# EAGLE design dice (EAGLE 6.3)
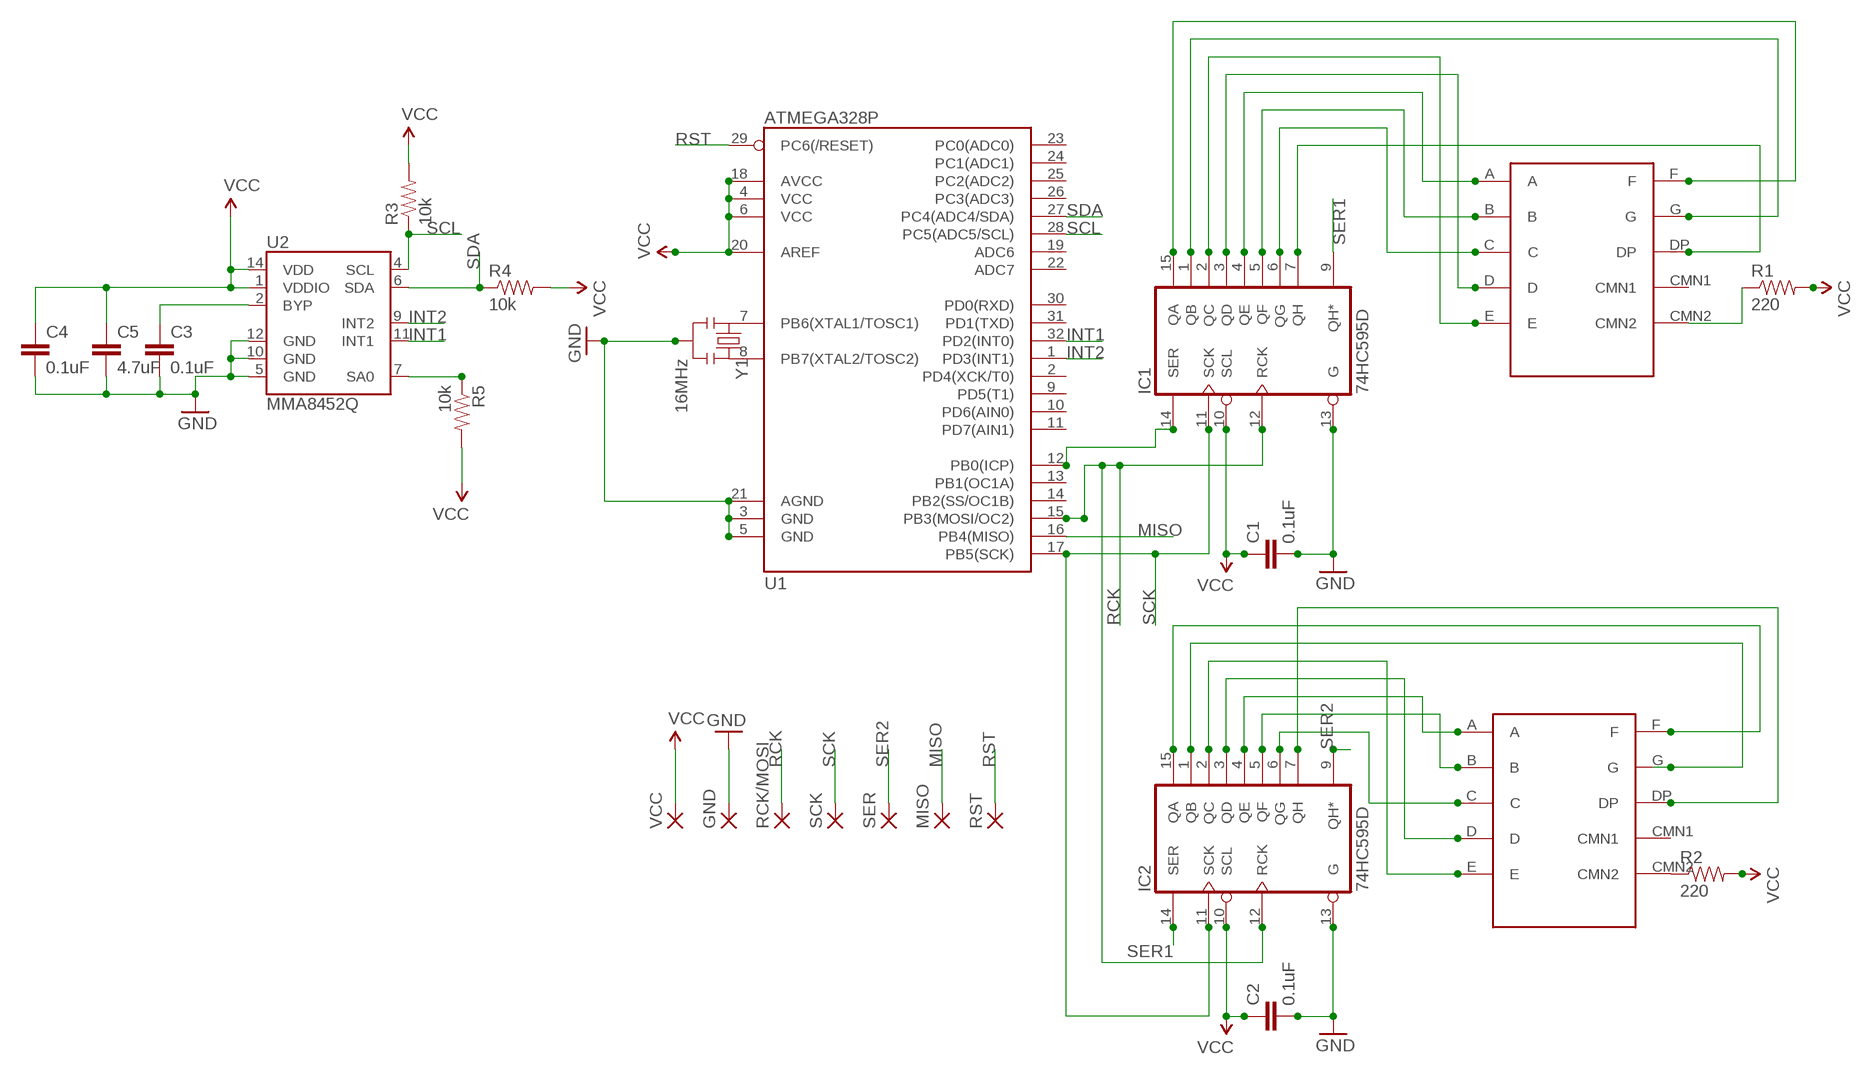
[diagram p0: schematic, sheet 1]

## Parts
C1  0.1uF  .1UF-CER  [0402-CAP]
C2  0.1uF  .1UF-CER  [0402-CAP]
C3  0.1uF  .1UF-CER  [0402-CAP]
C4  0.1uF  .1UF-CER  [0402-CAP]
C5  4.7uF  4.7UF-6.3V-10%(0603)  [0402-CAP]
GND  1,6/0,8  [1,6/0,8]
IC1  74HC595D  [SO16]
IC2  74HC595D  [SO16]
MISO  1,6/0,8  [1,6/0,8]
R1  220  220-5%  [0603-RES]
R2  220  220-5%  [0603-RES]
R3  10k  RESISTOR0402-RES  [0402-RES]
R4  10k  RESISTOR0402-RES  [0402-RES]
R5  10k  RESISTOR0402-RES  [0402-RES]
RCK/MOSI  1,6/0,8  [1,6/0,8]
RST  1,6/0,8  [1,6/0,8]
SCK  1,6/0,8  [1,6/0,8]
SER  1,6/0,8  [1,6/0,8]
U1  ATMEGA328P  ATMEGA328_SMT  [TQFP32-08]
U2  MMA8452Q  [QFN-16_0.5MM]
U$1  LUMEXSMHTA5604RISIT  [7SEG-10SMD]
U$2  LUMEXSMHTA5604RISIT  [7SEG-10SMD]
VCC  1,6/0,8  [1,6/0,8]
Y1  16MHz  RESONATOR16MHZ  [RESONATOR-SMD]

## Nets
GND: C1.2 C2.2 C3.2 C4.2 C5.2 GND.1(P) IC1.13(G) IC2.13(G) U1.3(GND) U1.5(GND) U1.21(AGND) U2.5(GND) U2.10(GND) U2.12(GND) Y1.2
INT1: U1.32(PD2(INT0)) U2.11(INT1)
INT2: U1.1(PD3(INT1)) U2.9(INT2)
MISO: MISO.1(P) U1.16(PB4(MISO))
N$1: R1.1 U$1.CMN2
N$2: IC1.4(QE) U$1.A
N$3: IC1.14(SER) U1.12(PB0(ICP))
N$4: U1.8(PB7(XTAL2/TOSC2)) Y1.3
N$5: U1.7(PB6(XTAL1/TOSC1)) Y1.1
N$6: IC1.15(QA) U$1.F
N$7: IC1.1(QB) U$1.G
N$8: IC1.2(QC) U$1.E
N$9: IC1.3(QD) U$1.D
N$10: IC1.5(QF) U$1.B
N$11: IC1.6(QG) U$1.C
N$12: IC1.7(QH) U$1.DP
N$13: R2.1 U$2.CMN2
N$14: IC2.15(QA) U$2.F
N$15: IC2.1(QB) U$2.G
N$16: IC2.2(QC) U$2.E
N$17: IC2.3(QD) U$2.D
N$18: IC2.4(QE) U$2.A
N$19: IC2.5(QF) U$2.B
N$20: IC2.6(QG) U$2.C
N$21: IC2.7(QH) U$2.DP
N$24: R5.1 U2.7(SA0)
N$26: C3.1 U2.2(BYP)
RCK: IC1.12(RCK) IC2.12(RCK) RCK/MOSI.1(P) U1.15(PB3(MOSI/OC2))
RST: RST.1(P) U1.29(PC6(/RESET))
SCK: IC1.11(SCK) IC2.11(SCK) SCK.1(P) U1.17(PB5(SCK))
SCL: R3.1 U1.28(PC5(ADC5/SCL)) U2.4(SCL)
SDA: R4.1 U1.27(PC4(ADC4/SDA)) U2.6(SDA)
SER1: IC1.9(QH*) IC2.14(SER)
SER2: IC2.9(QH*) SER.1(P)
VCC: C1.1 C2.1 C4.1 C5.1 IC1.10(SCL) IC2.10(SCL) R1.2 R2.2 R3.2 R4.2 R5.2 U1.4(VCC) U1.6(VCC) U1.18(AVCC) U1.20(AREF) U2.1(VDDIO) U2.14(VDD) VCC.1(P)
Unconnected: U1.2(PD4(XCK/T0)) U1.9(PD5(T1)) U1.10(PD6(AIN0)) U1.11(PD7(AIN1)) U1.13(PB1(OC1A)) U1.14(PB2(SS/OC1B)) U1.19(ADC6) U1.22(ADC7) U1.23(PC0(ADC0)) U1.24(PC1(ADC1)) U1.25(PC2(ADC2)) U1.26(PC3(ADC3)) U1.30(PD0(RXD)) U1.31(PD1(TXD)) U$1.CMN1 U$2.CMN1

## Power pins joined to a net without a drawn wire
GND: IC1.8(GND) IC2.8(GND)
VCC: IC1.16(VCC) IC2.16(VCC)

## Library data of the parts
C1-C4 = SparkFun-Capacitors:.1UF-CER: .1uF ceramic SMT CAP-00810- 25V +80%/-20% (0603) CAP-08390- 100V 10% (0603) CAP-08604- 25V 5% (0603); PROD_ID: CAP-00810
C5 = SparkFun-Capacitors:4.7UF-6.3V-10%(0603): CAP-08280; PROD_ID: CAP-08280
GND MISO RCK/MOSI RST SCK SER VCC = wirepad:1,6/0,8: THROUGH-HOLE PAD
IC1 IC2 = 74xx-eu:74*595: 8-bit SHIFT REGISTER, output latch
R1 R2 = SparkFun-Resistors:220-5%: 220-ohm SMT 1/8W - 5% (0805) RES-07866; PROD_ID: RES-07866
R3-R5 = SparkFun-Resistors:RESISTOR: Resistor Basic schematic elements and footprints for 0603, 1206, and PTH resistors.
U1 = SparkFun-DigitalIC:ATMEGA328_SMT: 32-Pin Atmega328 part Commonly used on Arduino compatible boards Available in QFP and QFN packages TQFP is IC-09069 QFN is non-stock; PROD_ID: IC-09069
U2 = SparkFun-Sensors:MMA8452Q: MMA8452Q 3-Axis, 12/8-bit Digital Accelerometer Supply Voltage: 1.6-3.6V Range: +/- 2g, 4g, 8g Interface: I2C, 12-bit and 8-bit ODR: 1.56 Hz - 800 Hz Package: QFN-16 http://cache.freescale.com/files/sensors/doc/data_sheet/MMA8452Q.pdf
U$1 U$2 = sevensegment:LUMEXSMHTA5604RISIT: Red 10 pin SMD 0.56" 7 Segment
Y1 = SparkFun-FreqCtrl:RESONATOR: Resonator Small SMD resonator. Used, eg, on the Arduino Pro/ Pro Mini boards. 8MHz- XTAL-08895 16MHz- XTAL-08900; PROD_ID: XTAL-08900

## Board
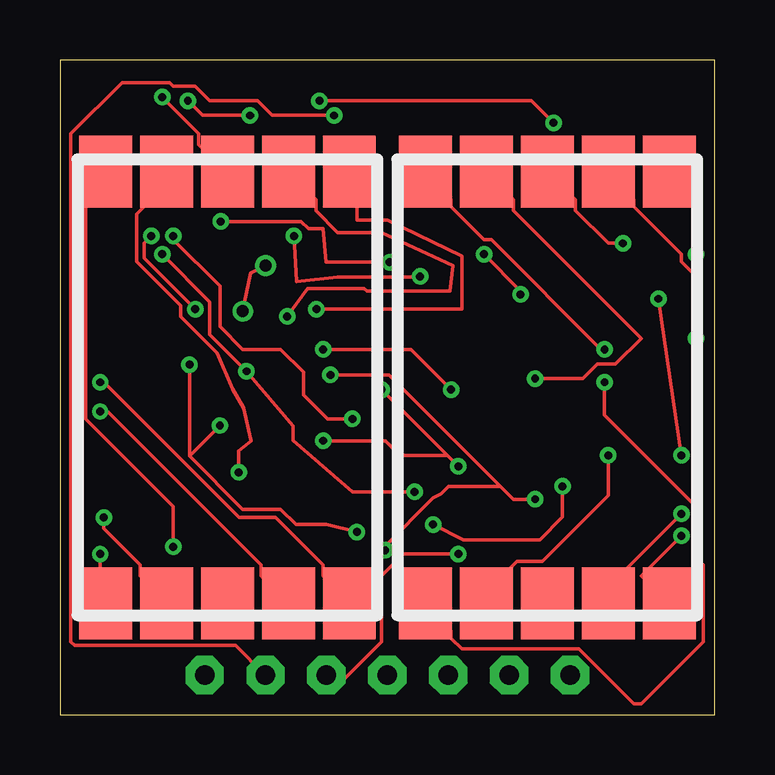
[diagram p1: board, top side]
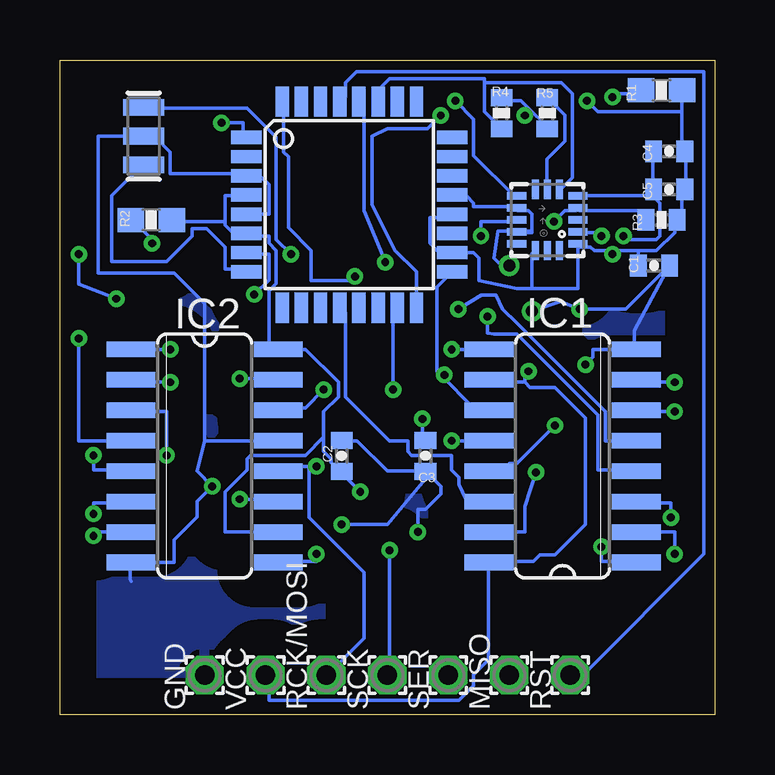
[diagram p2: board, bottom side, seen from below]

Size 27.3 x 27.3 mm. Coordinates in mm from the lower left corner, seen from the top.
Outline: 27.3,0 27.3,27.3 0,27.3 0,0 27.3,0
Copper layers (1*16): Top 0.0356mm / dielectric 1.5011mm / Bottom 0.0356mm
Design rules "LaenPCBOrder": minimum track width 6mil, minimum drill 13mil, track to track 6mil, track to pad 6mil, pad to pad 6mil, via to via 6mil, smd to smd 6mil, copper to edge 15mil, drill to drill 6mil, minimum pad ring 7mil, minimum via ring 7mil, stop-mask expansion 4mil, vias tented up to drill 0mil, thermal gap 10mil

### Footprints (pad centres in the part's own frame; a part is rotated, then mirrored left to right if it is on the bottom)
0402-CAP = smd 0.7 x 0.9: 1 -0.65,0; 2 0.65,0
1,6/0,8 = drill 0.813 pad 1.6 octagon: 1 0,0
SO16 = smd 0.66 x 2.032: 1 -4.445,-3.073; 2 -3.175,-3.073; 3 -1.905,-3.073; 4 -0.635,-3.073; 5 0.635,-3.073; 6 1.905,-3.073; 7 3.175,-3.073; 8 4.445,-3.073; 9 4.445,3.073; 10 3.175,3.073; 11 1.905,3.073; 12 0.635,3.073; 13 -0.635,3.073; 14 -1.905,3.073; 15 -3.175,3.073; 16 -4.445,3.073
0603-RES = smd 1.1 x 1: 1 -0.85,0; 2 0.85,0
0402-RES = smd 0.7 x 0.9: 1 -0.65,0; 2 0.65,0
TQFP32-08 = smd 1.27 x 0.559: 1 -4.293,2.8; 2 -4.293,2; 3 -4.293,1.2; 4 -4.293,0.4; 5 -4.293,-0.4; 6 -4.293,-1.2; 7 -4.293,-2; 8 -4.293,-2.8; 17 4.293,-2.8; 18 4.293,-2; 19 4.293,-1.2; 20 4.293,-0.4; 21 4.293,0.4; 22 4.293,1.2; 23 4.293,2; 24 4.293,2.8 | smd 0.559 x 1.27: 9 -2.8,-4.293; 10 -2,-4.293; 11 -1.2,-4.293; 12 -0.4,-4.293; 13 0.4,-4.293; 14 1.2,-4.293; 15 2,-4.293; 16 2.8,-4.293; 25 2.8,4.293; 26 2,4.293; 27 1.2,4.293; 28 0.4,4.293; 29 -0.4,4.293; 30 -1.2,4.293; 31 -2,4.293; 32 -2.8,4.293
QFN-16_0.5MM = smd 0.8 x 0.3: 1 -1.275,1; 2 -1.275,0.5; 3 -1.275,0; 4 -1.275,-0.5; 5 -1.275,-1; 9 1.275,-1; 10 1.275,-0.5; 11 1.275,0; 12 1.275,0.5; 13 1.275,1 | smd 0.3 x 0.8: 6 -0.5,-1.275; 7 0,-1.275; 8 0.5,-1.275; 14 0.5,1.275; 15 0,1.275; 16 -0.5,1.275
7SEG-10SMD = smd 2.2 x 3: A 2.54,9; B 5.08,9; C 2.54,-9; CMN1 0,-9; CMN2 0,9; D -2.54,-9; DP 5.08,-9; E -5.08,-9; F -2.54,9; G -5.08,9
RESONATOR-SMD = smd 0.7 x 1.7: 1 -1.2,0; 2 0,0; 3 1.2,0

### Placement (x,y rotation side)
C1  2.54,18.73 0 bottom
C2  15.56,10.79 90 bottom
C3  12.06,10.79 270 bottom
C4  1.91,23.5 180 bottom
C5  1.91,21.91 180 bottom
GND  21.27,1.65 0 bottom
IC1  6.35,10.79 90 bottom
IC2  21.27,10.79 270 bottom
MISO  8.57,1.65 0 bottom
R1  2.22,26.04 0 bottom
R2  23.5,20.64 0 bottom
R3  2.22,20.64 0 bottom
R4  8.89,25.08 90 bottom
R5  6.99,25.08 270 bottom
RCK/MOSI  16.19,1.65 0 bottom
RST  6.03,1.65 0 bottom
SCK  13.65,1.65 0 bottom
SER  11.11,1.65 0 bottom
U1  15.24,21.27 0 bottom
U2  6.99,20.64 180 bottom
U$1  6.99,13.65 0 top
U$2  20.32,13.65 0 top
VCC  18.73,1.65 0 bottom
Y1  23.81,24.13 270 bottom

### Tracks (layer width: path | path; a pad name or v marks a point on that pad's centre or on a via)
GND  (via drill 0.33, 0.5)
  Top 0.152: v3.81,19.96 3.5,19.66 3.5,19.05 v5.64,16.92 | v8.57,18.73 7.94,18.41 v7.62,16.83 | v15.56,7.94 16.83,7.3 20,7.3 20.95,8.26 v20.95,9.53 | 5.4,10.79 7.62,8.57 9.21,8.57 9.84,7.94 11.11,7.94 v12.38,7.62 | v6.67,12.06 5.4,10.79 | v5.4,14.61 5.4,10.79
  Bottom 0.152: 2.59,21.64 5.64,21.64 U2.5 | 2.59,21.64 2.59,21.79 C5.2 | C4.2 2.59,23.47 2.59,21.95 C5.2 | 7.62,20.16 7.62,20.88 7.77,21.03 8.23,21.03 U2.10 8.38,21.18 10.06,21.18 10.06,21.34 10.36,21.64 10.82,21.64 U1.21 | 7.62,20.16 7.62,20.12 8.23,20.12 U2.12 | U1.5 19.51,20.88 18.59,20.88 18.59,22.1 18.9,22.4 19.51,22.4 U1.3 19.66,22.55 22.71,22.55 22.71,23.47 23.32,24.08 23.77,24.08 Y1.2 25.72,24.13 25.72,18.41 22.54,18.41 21.27,17.14 21.27,11.43 | 3.35,15.24 3.35,16.03 C1.2 3.71,16.92 v5.64,16.92 6.44,17.23 v7.62,16.83 | 3.35,15.24 IC1.8 | 24.35,5.56 24.38,5.64 24.38,6.25 IC2.8 22.54,6.35 22.54,7.3 21.59,8.26 21.59,8.89 v20.95,9.53 21.59,10.16 21.27,11.43 | 2.59,21.64 2.29,21.34 2.29,19.96 2.44,19.81 3.81,19.81 v3.81,19.96 | 2.59,21.64 C5.2 | 7.62,20.16 9.05,20.16 9.21,19.05 8.89,18.73 v8.57,18.73 | IC1.13 8.89,10.16 8.57,10.48 8.26,10.48 v6.67,12.06 | C3.2 11.43,9.53 11.43,9.21 12.06,8.57 12.38,8.57 v12.38,7.62 | C2.2 15.56,11.43 14.92,11.43 13.65,10.16 12.08,10.16 C3.2 | C3.2 12.06,9.84 13.65,7.94 v15.56,7.94 | 21.27,11.43 IC2.13 | 3.35,15.24 5.08,15.24 5.08,14.92 v5.4,14.61
  pour Bottom (isolate 1.524): -2.54,28.57 -2.54,-1.91 30.48,-1.91 30.8,28.26
INT1  (via drill 0.33)
  Top 0.152: v9.75,19.96 9.87,18.06 11.58,18.25 14.99,18.25 v15.01,18.27
  Bottom 0.152: v9.75,19.96 9.75,20.57 8.38,20.57 U2.11 | U1.32 17.98,25.45 17.98,23.47 17.78,23.27 17.78,20.32 16.83,19.37 16.83,18.1 15.19,18.1 v15.01,18.27
INT2  (via drill 0.33)
  Top 0.152: v10.82,25.6 19.66,25.6 v20.57,24.69
  Bottom 0.152: v10.82,25.6 10.06,24.84 10.06,23.32 8.38,21.64 U2.9 | v20.57,24.69 19.66,24.69 19.66,24.08 U1.1
MISO  (via drill 0.33)
  Top 0.152: v11.43,24.99 8.84,24.99 8.23,25.6 6.25,25.6 5.64,26.21 4.72,26.21 4.57,26.36 2.59,26.36 0.46,24.23 0.46,3.05 0.61,2.9 7.32,2.9 8.53,1.68 MISO.1
  Bottom 0.152: v11.43,24.99 11.98,24.45 13.65,24.45 14.29,24.13 14.29,21.27 13.34,19.37 12.44,18.47 U1.16 12.5,17.07
N$1  (via drill 0.33)
  Top 0.152: v4.27,25.76 5.79,24.23 5.79,23.77 6.86,22.71 U$1.CMN2
  Bottom 0.152: v4.27,25.76 4.27,25.91 3.2,25.91 R1.1
N$2  (via drill 0.33)
  Top 0.152: v9.47,16.61 10.32,17.78 12.69,17.78 12.8,17.67 16.27,17.67 16.38,18.73 13.41,20.12 11.58,20.12 10.67,21.03 10.67,21.49 9.6,22.55 U$1.A
  Bottom 0.152: IC1.4 3.35,10.21 4.88,10.21 4.88,12.5 8.26,15.88 9.21,15.88 9.47,15.93 v9.47,16.61
N$3
  Bottom 0.152: U1.12 15.54,16.92 15.39,16.76 15.39,13.26 13.56,11.43 12.8,11.43 12.8,10.97 12.65,10.82 10.97,10.82 10.97,10.21 10.67,9.91 10.67,9.6 10.38,8.99 9.77,8.99 IC1.14
N$4
  Bottom 0.152: U1.8 19.66,18.59 20.42,18.59 20.42,19.51 21.18,20.27 21.79,20.27 21.79,19.96 22.86,18.9 25.15,18.9 25.15,21.64 23.93,22.86 Y1.3
N$5  (via drill 0.33)
  Top 0.152: v19.2,17.53 19.2,17.68 v17.68,19.2
  Bottom 0.152: v19.2,17.53 18.59,18.14 18.59,19.2 19.51,19.2 U1.7 | v17.68,19.2 18.29,19.81 18.29,24.08 19.51,25.3 23.77,25.3 Y1.1
N$6  (via drill 0.33)
  Top 0.152: v7.46,10.11 7.46,11 7.98,11.43 7.66,12.8 7.19,13.59 6.55,15.09 5.03,16.61 5.03,17.07 3.2,18.9 3.2,20.88 4.72,22.4 4.57,22.55 U$1.F
  Bottom 0.152: IC1.15 7.92,7.62 7.92,8.69 v7.46,10.11
N$7  (via drill 0.33)
  Top 0.152: v4.72,7.01 4.72,8.69 1.07,12.34 1.07,21.79 1.83,22.55 U$1.G
  Bottom 0.152: v4.72,7.01 4.72,6.4 3.35,6.4 IC1.1
N$8  (via drill 0.33)
  Top 0.152: v1.68,6.71 1.68,4.88 1.83,4.72 U$1.E
  Bottom 0.152: IC1.2 1.68,7.62 v1.68,6.71
N$9  (via drill 0.33)
  Top 0.152: v1.83,8.23 1.83,7.77 3.35,6.25 3.35,5.79 4.42,4.72 U$1.D
  Bottom 0.152: v1.83,8.23 1.83,8.84 3.2,8.84 IC1.3
N$10  (via drill 0.33)
  Top 0.152: v10.69,16.92 16.76,16.92 16.75,19.13 13.65,20.64 12.38,20.64 12.38,22.36 12.19,22.55 U$1.B
  Bottom 0.152: IC1.5 4.57,11.43 4.57,12.65 8.23,16.31 8.87,16.92 9.13,17.5 9.74,17.5 v10.69,16.92
N$11  (via drill 0.33)
  Top 0.152: v1.68,12.65 1.98,12.65 8.38,6.25 8.38,5.79 9.45,4.72 U$1.C
  Bottom 0.152: v1.68,12.65 3.2,12.65 IC1.6
N$12  (via drill 0.33)
  Top 0.152: v1.68,13.87 1.83,13.87 7.47,8.23 8.99,8.23 10.97,6.25 10.97,5.79 12.04,4.72 U$1.DP
  Bottom 0.152: v1.68,13.87 3.2,13.87 IC1.7
N$13  (via drill 0.33)
  Top 0.152: v23.47,19.66 22.86,19.66 21.49,21.03 21.49,21.49 20.42,22.55 U$2.CMN2
  Bottom 0.152: v23.47,19.66 23.47,19.81 24.23,20.57 R2.1
N$14  (via drill 0.33)
  Top 0.152: v19.81,14.02 21.79,14.02 22.4,14.63 23.16,14.63 24.23,15.7 18.9,21.03 18.9,21.49 17.83,22.55 U$2.F
  Bottom 0.152: v19.81,14.02 18.29,14.02 IC2.15
N$15  (via drill 0.33)
  Top 0.152: v22.71,15.24 22.55,15.24 17.98,19.81 17.68,19.81 16.31,21.18 16.31,21.49 15.24,22.55 U$2.G
  Bottom 0.152: v22.71,15.24 IC2.1
N$16  (via drill 0.33)
  Top 0.152: v22.71,13.87 22.71,12.5 26.52,8.69 26.52,6.55 26.82,6.25 26.82,3.05 24.23,0.46 23.93,0.46 21.64,2.74 16.76,2.74 16.31,3.2 16.31,3.5 15.24,4.57 U$2.E
  Bottom 0.152: v22.71,13.87 24.23,13.87 IC2.2
N$17  (via drill 0.33)
  Top 0.152: v22.86,10.82 22.86,9.14 20.12,6.4 19.05,6.4 17.53,4.88 17.68,4.72 U$2.D
  Bottom 0.152: v22.86,10.82 22.86,12.65 24.23,12.65 IC2.3
N$18  (via drill 0.33)
  Top 0.152: v26.52,15.7 26.52,18.29 25.91,18.9 25.91,19.2 23.93,21.18 23.93,21.49 22.86,22.55 U$2.A
  Bottom 0.152: IC2.4 26.52,11.43 v26.52,15.7
N$19  (via drill 0.33)
  Top 0.152: v24.96,17.35 v25.91,10.82 | v26.52,19.2 26.52,21.49 25.45,22.55 U$2.B
  Bottom 0.152: v25.91,10.82 25.91,10.21 24.38,10.21 IC2.5 | v24.96,17.35 26.52,17.96 v26.52,19.2
N$20  (via drill 0.33)
  Top 0.152: v25.91,8.38 22.55,5.03 22.86,4.72 U$2.C
  Bottom 0.152: v25.91,8.38 25.91,8.84 24.38,8.84 IC2.6
N$21  (via drill 0.33)
  Top 0.152: v25.91,7.47 24.23,5.79 25.3,4.72 U$2.DP
  Bottom 0.152: IC2.7 25.91,7.62 v25.91,7.47
N$24
  Bottom 0.152: U2.7 7.01,21.95 7.01,23.16 6.25,23.93 6.25,24.99 6.86,25.6 R5.1
N$26  (via drill 0.33)
  Top 0.152: v4.72,19.96 4.72,19.81 6.67,17.87 6.67,16.19 7.62,15.24 9.21,15.24 10.16,14.29 10.16,13.34 11.15,12.34 v12.19,12.34
  Bottom 0.152: v4.72,19.96 4.72,20.12 5.64,20.12 U2.2 | v12.19,12.34 12.19,11.58 C3.1
RCK  (via drill 0.33)
  Top 0.152: v16.61,10.36 16.15,10.82 | 16.15,10.82 v13.41,13.56 | v10.97,11.43 13.56,11.43 14.17,10.82 16.15,10.82
  Bottom 0.152: v13.41,13.56 13.41,16.76 13.26,16.92 U1.15 | 16.92,10.36 18.14,10.36 18.14,10.21 IC2.12 | v10.97,11.43 IC1.12 | 16.92,10.36 16.92,8.23 14.63,5.94 14.63,3.2 16.15,1.68 RCK/MOSI.1 | 16.92,10.36 v16.61,10.36
RST
  Bottom 0.152: U1.29 15.54,25.6 15.39,25.76 15.39,26.36 14.94,26.82 0.46,26.82 0.46,6.71 5.49,1.68 5.94,1.68 RST.1
SCK  (via drill 0.33)
  Top 0.152: v19.81,8.99 18.9,8.99 18.36,9.53 | 18.36,9.53 13.72,14.17 v11.28,14.17 | 18.36,9.53 16.19,9.53 15.88,9.21 15.56,9.05 13.56,7.05 v13.56,6.86
  Bottom 0.152: 11.43,14.17 10.06,12.8 9.45,12.8 IC1.11 | 11.43,14.17 11.58,14.33 11.58,17.83 10.97,18.44 U1.17 | v19.81,8.99 18.29,8.99 IC2.11 | 11.43,14.17 v11.28,14.17 | v13.56,6.86 13.56,1.68 SCK.1
SCL  (via drill 0.33)
  Top 0.152: v13.74,18.87 11.1,18.87 10.97,20.27 10.36,20.27 10.06,20.57 v6.71,20.57
  Bottom 0.152: R3.1 2.9,20.73 2.9,21.03 5.64,21.03 U2.4 5.79,21.03 6.25,21.03 v6.71,20.57 | v13.74,18.87 14.63,21.03 14.63,25.3 14.78,25.45 U1.28
SDA
  Bottom 0.152: 9.6,26.36 6.4,26.36 5.94,25.91 5.94,22.4 6.4,21.95 U2.6 | 9.6,26.36 9.6,25.15 8.99,24.54 R4.1 | 9.6,26.36 9.6,26.52 13.56,26.52 13.87,26.21 13.87,25.76 14.02,25.6 U1.27
SER1  (via drill 0.33)
  Top 0.152: v10.97,15.24 14.63,15.24 v16.31,13.56
  Bottom 0.152: v10.97,15.24 IC1.9 | v16.31,13.56 17.07,12.8 18.14,12.8 IC2.14
SER2  (via drill 0.33)
  Top 0.152: v16.61,6.71 14.33,6.71 13.41,5.79 13.41,3.05 11.58,1.22 11.12,1.68 SER.1
  Bottom 0.152: v16.61,6.71 16.61,6.4 18.14,6.4 IC2.9
VCC  (via drill 0.33)
  Top 0.152: v7.92,24.99 5.94,24.99 v5.33,25.6 | v4.27,19.2 6.25,17.22 6.25,15.85 v7.77,14.33 9.73,12.05 9.73,11.44 12.19,9.3 v14.78,9.3
  Bottom 0.152: 20.42,20.57 22.55,20.57 R2.2 | 20.42,20.57 20.42,20.42 20.12,20.12 19.66,20.12 U1.6 19.51,19.96 18.59,19.96 18.59,19.66 18.29,19.36 18.29,17.98 18.59,17.68 18.59,15.54 18.29,15.24 IC2.16 17.07,15.24 15.7,13.87 15.7,13.26 16.31,12.65 16.31,11.58 | 20.42,20.57 20.42,21.64 19.66,21.64 U1.4 | 16.31,11.58 16.31,10.97 16,10.67 16,10.52 15.7,10.21 C2.1 15.54,10.06 v14.78,9.3 | IC2.10 20.42,7.62 20.42,9.3 19.51,10.21 19.51,10.67 19.36,10.82 17.07,10.82 16.31,11.58 | U1.20 10.97,20.73 11.89,20.73 11.89,19.66 11.58,19.36 10.97,19.36 U1.18 10.06,19.27 9.84,19.05 9.84,18.1 8.26,17.78 7.62,17.78 | 3.2,19.36 4.27,19.36 | 4.27,19.36 5.03,19.36 5.18,19.51 5.64,19.51 U2.1 5.71,17.78 7.62,17.78 | 3.2,19.36 3.2,18.75 C1.1 | 7.77,25.3 8.08,25.6 8.84,25.6 R4.2 | 7.77,25.3 7.01,24.54 R5.2 | 1.37,25.15 1.37,23.62 C4.1 1.22,23.47 1.22,21.95 C5.1 1.37,21.79 1.37,20.88 1.52,20.73 R3.2 1.68,20.57 1.68,20.12 2.44,19.36 3.2,19.36 | 1.37,25.15 1.37,25.91 R1.2 | 7.77,25.3 7.92,25.15 v7.92,24.99 | v5.33,25.6 4.88,25.15 1.37,25.15 | VCC.1 18.59,1.52 18.59,0.61 10.67,0.61 10.06,1.22 10.06,1.68 9.45,2.29 9.45,6.25 IC1.16 9.3,6.4 7.57,6.4 7.3,6.67 6.67,6.67 5.4,7.94 5.4,12.38 6.67,13.65 7.71,13.65 7.92,13.87 | 7.92,13.87 9.3,13.87 IC1.10 | v4.27,19.2 4.27,19.36 | v7.77,14.33 7.92,14.17 7.92,13.87 | U2.14 7.62,19.23 7.62,17.78